# Altium schematic sheet Part1.4.SchDoc
size A
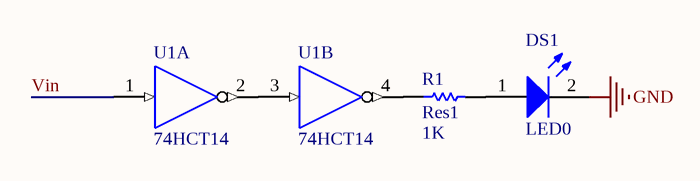
[diagram p0: Part1.4.SchDoc]

## Parts
DS1  LED0  [LED-0]
R1  Res1  value 1K  [AXIAL-0.3]
U1  74HCT14  [DIP-14/D19.7]  (parts A,B of 6)

## Nets
GND: DS1.2(K) U1.7(GND)
VCC: U1.14(VCC)
Vin: U1.1(I)
NetDS1_1: DS1.1(A) R1.2
NetR1_1: R1.1 U1.4(~{O})
NetU1_2: U1.2(~{O}) U1.3(I)

## Library data of the parts
DS1 = LED0: Typical INFRARED GaAs LED; Manufacturer: Generic Components; Class: Optoelectronic; Published: 08/06/2000; Publisher: Altium Hobart Technology Centre; SubClass: LED
R1 = Res1: Resistor; Manufacturer: Generic Components; Class: Passive; Published: 08/06/2000; Publisher: Altium Hobart Technology Centre; SubClass: Resistor
U1 = 74xxx14: Hex Inverter with Schmitt Trigger Input; Manufacturer: Fairchild Semiconductor; Class: Logic; SubClass: Gate; Published: 15/04/2002; Publisher: Altium Hobart Technology Centre